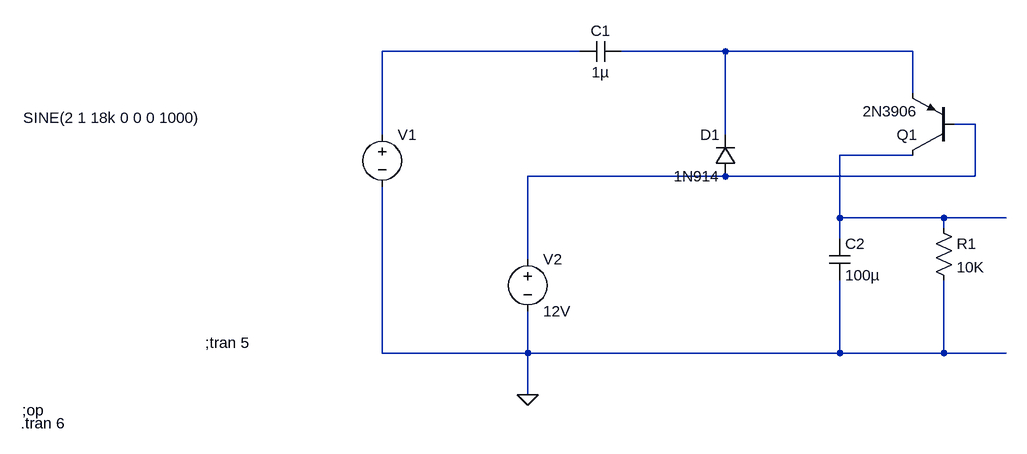
[diagram p0: schematic Frequency to Voltage converter_SPICE.asc]
Frequency to Voltage converter_SPICE.asc, the LTspice schematic file:
Version 4
SHEET 1 964 680
WIRE 304 -64 0 -64
WIRE 528 -64 368 -64
WIRE 816 -64 528 -64
WIRE 816 0 816 -64
WIRE 912 48 880 48
WIRE 0 64 0 -64
WIRE 528 64 528 -64
WIRE 816 96 704 96
WIRE 528 128 224 128
WIRE 912 128 912 48
WIRE 912 128 528 128
WIRE 704 192 704 96
WIRE 864 192 704 192
WIRE 960 192 864 192
WIRE 864 208 864 192
WIRE 704 224 704 192
WIRE 224 256 224 128
WIRE 0 400 0 144
WIRE 224 400 224 336
WIRE 224 400 0 400
WIRE 704 400 704 288
WIRE 704 400 224 400
WIRE 864 400 864 288
WIRE 864 400 704 400
WIRE 960 400 864 400
WIRE 224 464 224 400
FLAG 224 464 0
SYMBOL voltage 0 48 R0
WINDOW 3 -552 -10 Left 2
WINDOW 123 -552 18 Left 2
WINDOW 39 0 0 Left 0
SYMATTR InstName V1
SYMATTR Value SINE(2 1 18k 0 0 0 1000)
SYMBOL voltage 224 240 R0
WINDOW 123 0 0 Left 0
WINDOW 39 0 0 Left 0
SYMATTR InstName V2
SYMATTR Value 12V
SYMBOL cap 368 -80 R90
WINDOW 0 0 32 VBottom 2
WINDOW 3 32 32 VTop 2
SYMATTR InstName C1
SYMATTR Value 1µ
SYMBOL diode 544 128 R180
WINDOW 0 24 64 Left 2
WINDOW 3 24 0 Left 2
SYMATTR InstName D1
SYMATTR Value 1N914
SYMBOL pnp 880 96 R180
SYMATTR InstName Q1
SYMATTR Value 2N3906
SYMBOL cap 688 224 R0
SYMATTR InstName C2
SYMATTR Value 100µ
SYMBOL res 848 192 R0
SYMATTR InstName R1
SYMATTR Value 10K
TEXT -554 488 Left 2 !;op
TEXT -272 384 Left 2 !;tran 5
TEXT -556 508 Left 2 !.tran 6

The netlist it stands for:
* Frequency to Voltage converter_SPICE.asc
V1 N001 0 SINE(2 1 18k 0 0 0 1000)
V2 N003 0 12V
C1 N002 N001 1µ
D1 N003 N002 1N914
Q1 N004 N003 N002 0 2N3906
C2 N004 0 100µ
R1 N004 0 10K
.model D D
.lib standard.dio
.model NPN NPN
.model PNP PNP
.lib standard.bjt
;op
;tran 5
.tran 6
.backanno
.end